# Altium project AUE_Projekt_Zaliczeniowy.PrjPcb
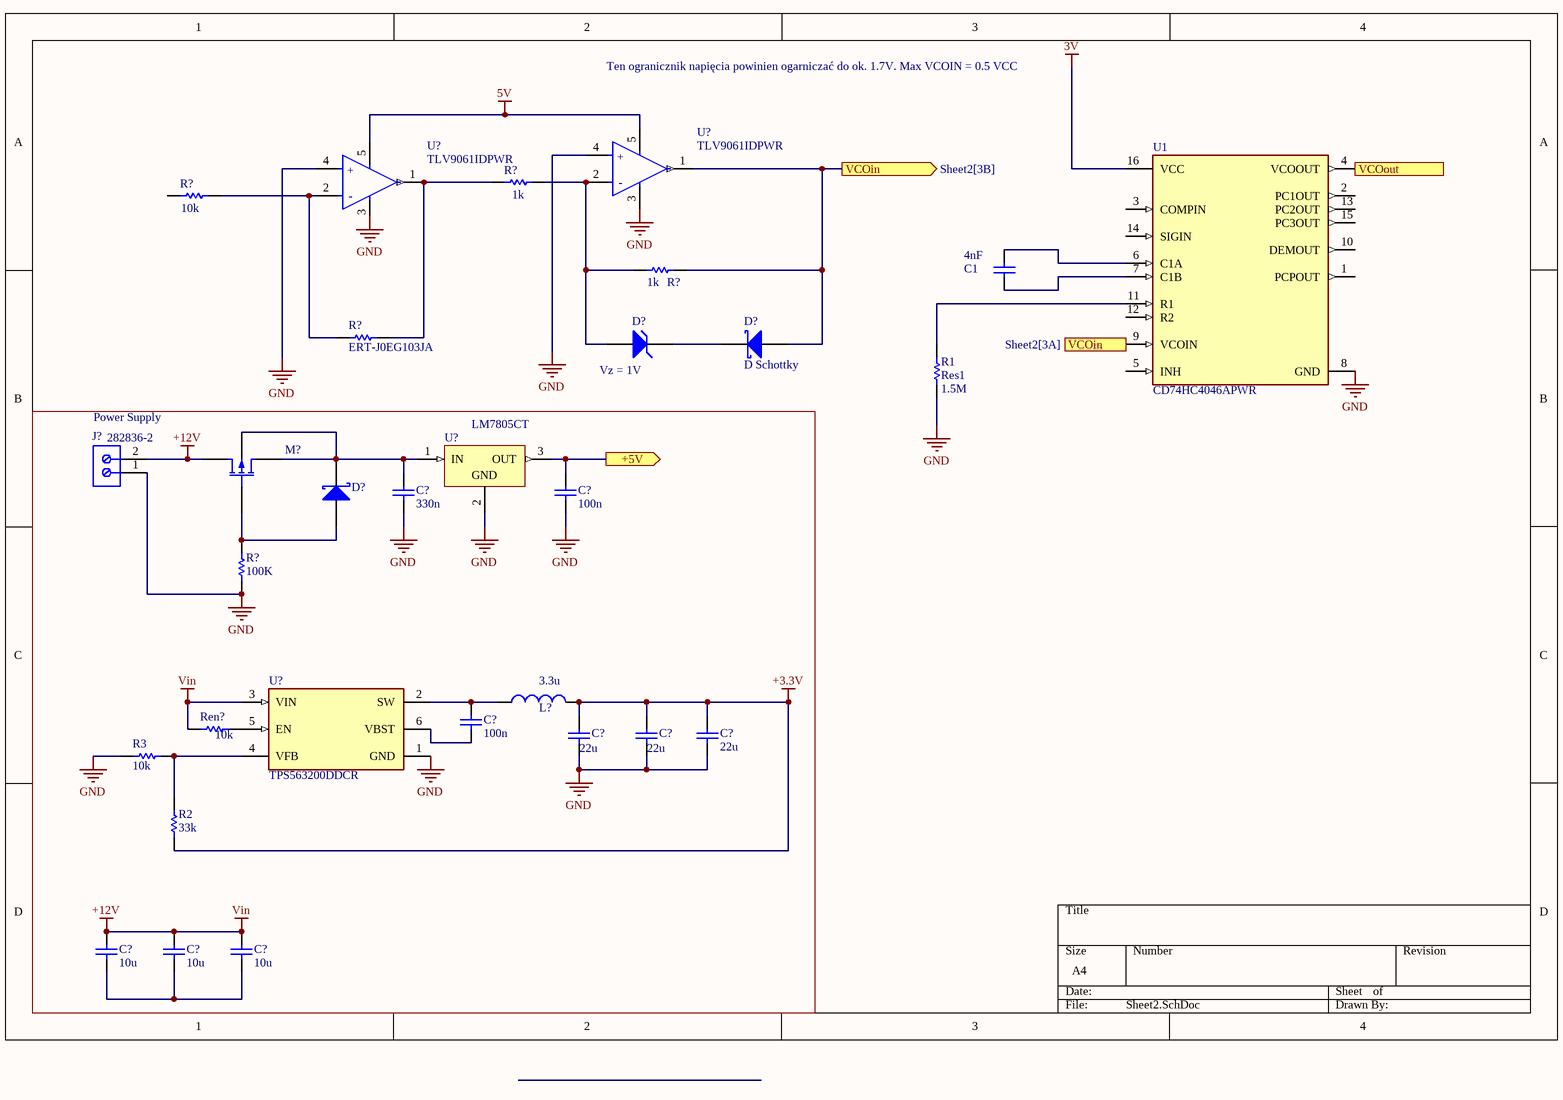
[diagram p0: Sheet2.SchDoc]
1 sheet, 30 parts. Net scope: flat (ports and power ports of the same name join across sheets).

## Sheet Sheet2.SchDoc
size A4; SheetNumber: 1; SheetTotal: 1; SPICEModelCacheDHTRKKRJ: <root> / <DocumentId>DHTRKKRJ</DocumentId> / <CacheFrame Number="0"> / <Model Name="zener" Kind="MDL"> / <Text>*ZENER / *Default Zener 10V @ 10mA / *Zener Diode Pinout: A,K / .MODEL ZENER D( BV=10 IBV=10E-3 )</Text> / </Model> / <Model Name="skydiode" Kind="MDL"> / <Text>*Default Schottky Diode / *Schottky Diode Pinout: A,K / .MODEL SKYDIODE D(EG=0.69 XTI=2)</Text> / </Model> / </CacheFrame> / </root>

### Parts
(Parts that share a designator on the sheet are numbered #1, #2 ... from top to bottom, then left to right.)
C1  value 4nF  [RAD-0.3]
C?#1  value 330n  (hidden comment: Capacitor)
C?#2  value 100n  (hidden comment: Capacitor)
C?#3  value 100n  (hidden comment: Capacitor)
C?#4  value 22u  (hidden comment: Capacitor)
C?#5  value 22u  (hidden comment: Capacitor)
C?#6  value 22u  (hidden comment: Capacitor)
C?#7  value 10u  (hidden comment: Capacitor)
C?#8  value 10u  (hidden comment: Capacitor)
C?#9  value 10u  (hidden comment: Capacitor)
D?#1  Vz = 1V  [DIODE-0.7]
D?#2  D Schottky  [SMB]
D?#3  Shottky Diode  (value not drawn)
J?  282836-2  [TECO-282836-2_V]
L?  value 3.3u  (hidden comment: Inductor)
M?  P-channel MOSFET MOS9 Model  (value not drawn)
R1  Res1  value 1.5M  [AXIAL-0.3]
R2  value 33k  (hidden comment: Resistor)
R3  value 10k  (hidden comment: Resistor)
R?#1  value 1k  [AXIAL-0.3]
R?#2  value 10k  [AXIAL-0.3]
R?#3  value 1k  [AXIAL-0.3]
R?#4  ERT-J0EG103JA  [RESC1005X40X25LL05T05]
R?#5  value 100K  (hidden comment: Resistor)
Ren?  value 10k  (hidden comment: Resistor)
U1  CD74HC4046APWR  [FP-PW0016A-IPC_C]
U?#1  TLV9061IDPWR  [FP-DPW0005A-MFG]
U?#2  TLV9061IDPWR  [FP-DPW0005A-MFG]
U?#3  LM7805CT  [FAIR-TO-220-3]
U?#4  TPS563200DDCR  [FP-DDC0006A-MFG]

### Blocks framed on the sheet
Power Supply: C?#1-C?#9 D?#3 J? L? M? R2 R3 R?#5 Ren? U?#3 U?#4

### Ports
+5V (out), VCOin (in, see Sheet2[3A]), VCOin (out, see Sheet2[3B]), VCOout (out)

### Nets
3V: U1.16(VCC)
5V: U?#1.5(V+) U?#2.5(V+)
+3.3V: C?#4.2 C?#5.2 C?#6.2 L?.2 R2.1
+12V: C?#7.2 C?#8.2 C?#9.2 J?.2 M?.1(D) Ren?.1 U?#4.3(VIN)  [also labelled Vin]
GND: C?#1.1 C?#2.1 C?#4.1 C?#5.1 C?#6.1 J?.1 R1.1 R3.1 R?#5.1 U1.8(GND) U?#1.3(V-) U?#1.4(IN+) U?#2.4(IN+) U?#3.2(GND) U?#4.1(GND)
NetC1_1: C1.1 U1.6(C1A)
NetC1_2: C1.2 U1.7(C1B)
NetC?#1_2: C?#1.2 D?#3.2(K) M?.3(S) M?.4(B) U?#3.1(IN)
NetC?#2_2: C?#2.2 U?#3.3(OUT) ; port +5V
NetC?#3_1: C?#3.1 U?#4.6(VBST)
NetC?#3_2: C?#3.2 L?.1 U?#4.2(SW)
NetC?#7_1: C?#7.1 C?#8.1 C?#9.1
NetD?#1_1: D?#1.1(A) R?#1.1 R?#3.2 U?#1.2(IN-)
NetD?#1_2: D?#1.2(K) D?#2.2(K)
NetD?#2_1: D?#2.1(A) R?#3.1 U1.9(VCOIN) U?#1.1(OUT) ; port VCOin
NetD?#3_1: D?#3.1(A) M?.2(G) R?#5.2
NetR1_2: R1.2 U1.11(R1)
NetR2_2: R2.2 R3.2 U?#4.4(VFB)
NetR?#1_2: R?#1.2 R?#4.2 U?#2.1(OUT)
NetR?#2_1: R?#2.1 R?#4.1 U?#2.2(IN-)
NetRen?_2: Ren?.2 U?#4.5(EN)
NetU1_4: U1.4(VCOOUT) ; port VCOout

Not connected (* = marked no-connect by the designer): R?#2 2; U1 1(PCPOUT) 2(PC1OUT) 3(COMPIN) 5(INH) 10(DEMOUT) 12(R2) 13(PC2OUT) 14(SIGIN) 15(PC3OUT); U?#2 3(V-)

### Notes on the sheet
- Ten ogranicznik napięcia powinien ogarniczać do ok. 1.7V. Max VCOIN = 0.5 VCC
- Labels drawn without touching a wire or pin: GND
- (in symbol CMP-04895-000058-1) +; -

### Library data of the parts
C1 = Cap: Capacitor; Published: 8-Jun-2000; LatestRevisionDate: 17-Jul-2002; LatestRevisionNote: Re-released for DXP Platform.; PackageReference: RAD-0.3; Publisher: Altium Limited; PackageDescription: Radial Cap, Thru-Hole; 2 Leads; 0.3 in Pin Spacing
C?#1-C?#9 = Capacitor: SimulationGenericComponent: True
D?#1 = D Zener: Zener Diode; Published: 8-Jun-2000; LatestRevisionDate: 17-Jul-2002; LatestRevisionNote: Re-released for DXP Platform.; PackageReference: DIODE-0.7; Publisher: Altium Limited; PackageDescription: Diode, Thru-Hole; 2 Leads; 0.7 in Pin Spacing
D?#2 = D Schottky: Schottky Diode; Published: 8-Jun-2000; LatestRevisionDate: 17-Jul-2002; LatestRevisionNote: Re-released for DXP Platform.; PackageReference: SMB; Publisher: Altium Limited; PackageDescription: DO-214-AA/SMB; 2 C-Bend Leads; Body 5.3 x 3.6 mm, inc. leads (LxW); Code_JEDEC: DO-214-AA
D?#3 = Shottky Diode: AF: 1; BV: 0; BV_MAX: 1e99; EG: 1.11; FC: 0.5; IBV: 0.001; IS: 1e-14; MJSW: 0.33; NTUN: 30; TNOM: 27; XTI: 3; SimulationGenericComponent: True; CJO: 0; CJP: 0; CTA: 0; CTP: 0; FCS: 0.5; FV_MAX: 1e99; IKF: 0; IKR: 0; ISR: 1e-14; JSW: 0; JTUN: 0; JTUNSW: 0; KEG: 1; KF: 0; LEVEL: 1; N: 1; NBV: 1; NR: 1; NS: 1; PHP: 1; RS: 0; TCV: 0; TLEV: 0; TLEVC: 0; TM1: 0; TM2: 0; TPB: 0; TPHP: 0; TRS: 0; TRS2: 0; TT: 0; TTT1: 0; TTT2: 0; VJ: 1; XTITUN: 3
J? = CMP-1684-00017-1: Female Header, Pitch 5 mm, 1 x 2 Position, Height 10 mm, Tail Length 3.5 mm, Rohs, Bulk; Manufacturer: TE Connectivity; Wire Gauge: 16-30AWG; Product Training Modules: Wire-to-BoardEurostyleTerminalBlocks; Clamp Material - Plating: Brass-NickelPlated; Voltage: 300V; Mating Orientation: HorizontalwithBoard; Current: 13.5A; Pitch: 0.197"(5.00mm); Screw Thread: M3; 3D Model: 282836-2.pdf; Other Names: 5ULV-02B / A98076; Dynamic Catalog: BuchananSeries; Number of Levels: 1; Torque - Screw: 0.68Nm(6Lb-In); Featured Product: EurostyleTerminalBlockConnectors; Positions Per Level: 2; Wire Termination: Screw-RisingCageClamp; Datasheet URL: http://www.te.com.cn/commerce/DocumentDelivery/DDEController?Action=showdoc&DocId=Catalog+Section%7F1308389_EUROSTYLE_TERMINAL_BLOCKS%7F0607%7Fpdf%7FEnglish%7FENG_CS_1308389_EUROSTYLE_TERMINAL_BLOCKS_0607.pdf%7F282836-2; Color: Green; Family: TerminalBlocks-WiretoBoard; RoHS Information: 282836-2StatementofCompliance; Standard Package: 300; Contact Material - Plating: Brass-TinPlated; Manufacturer URL: http://www.te.com; Housing Material: Polyamide(PA66),Nylon6/6; Features: Interlocking(Side); Package Description: Female Header, Pitch 5 mm, 1 x 2 Position, Height 10 mm, Tail Length 3.5 mm; Mounting Type: ThroughHole; Package Reference: THD; Packaging: Bulk; Series: Buchanan; Category: Connectors,Interconnects; Screw Material - Plating: Brass-NickelPlated
L? = Inductor: SimulationGenericComponent: True
M? = MOSFET P-ch Lev9: AF: 1; ALPHA: 0; FC: 0.5; IS: 1e-14; KAPPA: 0.2; KP: 2.07189e-05; MJSW: 0.33; PB: 0.8; PHI: 0.6; TNOM: 27; TOX: 1e-07; U0: 600; SimulationGenericComponent: True; CBD: 0; CBS: 0; CGBO: 0; CGDO: 0; CGSO: 0; CJ: 0; CJSW: 0; DELTA: 0; DELVTO: 0; ETA: 0; GAMMA: 0; INPUT_DELTA: 0; JS: 0; KF: 0; LD: 0; MJ: 0.5; NFS: 0; NSS: 0; NSUB: 0; RD: 0; RS: 0; RSH: 0; THETA: 0; TPG: 0; VMAX: 0; VTO: 0; WD: 0; XD: 0; XJ: 0; XL: 0; XW: 0
R1 R?#1-R?#3 = Res1: Resistor; Published: 8-Jun-2000; LatestRevisionDate: 17-Jul-2002; LatestRevisionNote: Re-released for DXP Platform.; PackageReference: AXIAL-0.3; Publisher: Altium Limited; PackageDescription: Axial Device, Thru-Hole; 2 Leads; 0.3 in Pin Spacing
R2 R3 R?#5 Ren? = Resistor: TC1: 0; SimulationGenericComponent: True; TC2: 0
R?#4 = CMP-2002-01180-1: Manufacturer: Panasonic; Part Number: ERT-J0EG103JA
U1 = CMP-0776-00067-4: IC PLL W/VCO 16-TSSOP; Max Supply Voltage: 6V; Number of Circuits: 1; Supply Current: 8uA; Max Frequency: 38MHz; Min Supply Voltage: 2V; Frequency: 18MHz; Input: CMOS; PLL: Yes; REACH SVHC: No SVHC; Height: 1.15mm; Series: 74HC; Min Operating Temperature: -55°C; Case/Package: TSSOP; Package Quantity: 2000; Length: 5mm; Nominal Supply Current: 8uA; Lead Free: Lead Free; Packaging: Tape and Reel; RoHS Compliant: Yes; Max Operating Temperature: 125°C; Number of Pins: 16; Weight: 0.002183oz; Number of Bits: 1; Width: 4.4mm; Mount: Surface Mount; Contact Plating: Gold; Number of Elements: 1; Radiation Hardening: No
U?#1 U?#2 = CMP-04895-000058-1: IC CMOS 1 CIRCUIT 5X2SON; Manufacturer: Texas Instruments; Voltage Gain: 100-130dB; Number Of Channels: 1; Gain Bandwidth: 10MHz; Max Supply Voltage: 5.5V; Input Bias Current: 0.0000005uA; Input Offset Voltage: 0.3mV; Standoff Height: 0mm; Nominal Supply Current: 538uA; Min Supply Voltage: 1.8V; Max Junction Temp: +150°C; ComponentLink2Description: Datasheet; Ambient Temperature Range High: +125°C; Device Class L1: Integrated Circuits (ICs); Device Class L2: Linear ICs; Height: 0.4mm; Manufacturer Part Number: TLV9061IDPWR; Octopart: https://octopart.com/tlv9061idpwr-texas+instruments-87700489; Digikey Description: IC CMOS 1 CIRCUIT 5X2SON; Automotive: No; Device Class L3: Amplifiers - Op Amps; Temperature Range Low: -40°C; RoHS: TRUE; Lead Free: Yes; Mouser Description: Operational Amplifier Single CMOS 6.5V/us 1.8V to 5.5V 5-Pin X2SON T/R; Ambient Temperature Range Low: -40°C; ComponentLink2URL: http://www.ti.com/lit/ds/symlink/tlv9061.pdf; Temperature Range High: +125°C; Category: IC; Package: DPW0005A; Temperature: -40°C to +125°C
U?#3 = CMP-2000-04938-1: Positive Voltage Regulator, 5 V, 1 A, -40 to 125 degC, 3-Pin TO-220, RoHS, Tube; Manufacturer: FairchildSemiconductor; Maximum Input Voltage: 35V; Maximum Quiescent Current: 8mA; Load Regulation: 100mV; Maximum Output Current: 2.2(Typ)A; Output Type: Fixed; Typical Dropout Voltage @ Current: 2@1AV; Rad Hard: No; Output Voltage: 5V; Accuracy: ±4%; Number of Outputs: 1; Category: LinearRegulator; Package Description: 3-Pin Through Hole Device, Body 10 x 4.5 mm, Pitch 2.54 mm; Packaging: Rail/Tube; Mounting: ThroughHole; Polarity: Positive; Manufacturer URL: https://www.fairchildsemi.com/; Line Regulation: 100mV; Datasheet Version: Aug-12; Datasheet URL: https://datasheet.ciiva.com/26904/lm7805ct-26904988.pdf; Package Reference: TO-220; Package URL: https://www.fairchildsemi.com/package-drawings/TO/TO220B03.pdf; Package: 3TO-220AB; Operating Temperature: -40to125degC; Type: Linear
U?#4 = CMP-04918-000155-1: IC REG BUCK ADJ 3A TSOT23-6; Quiescent Current: 190uA; Output Voltage: 7V; Min Input Voltage: 4.5V; Output Configuration: Positive; Number of Outputs: 1; Switching Frequency: 650kHz; Synchronous Rectifier: Yes; Min Output Voltage: 760mV; Output Type: Adjustable; Operating Supply Voltage: 17V; Max Operating Temperature: 125°C; Lead Free: Lead Free; Packaging: Tape and Reel; Radiation Hardening: No; Mount: Surface Mount; Contact Plating: Tin; Output Current: 3A; Max Output Voltage: 7V; Min Operating Temperature: -40°C; Case/Package: SOT-23-6; Max Output Current: 3A; Max Input Voltage: 17V